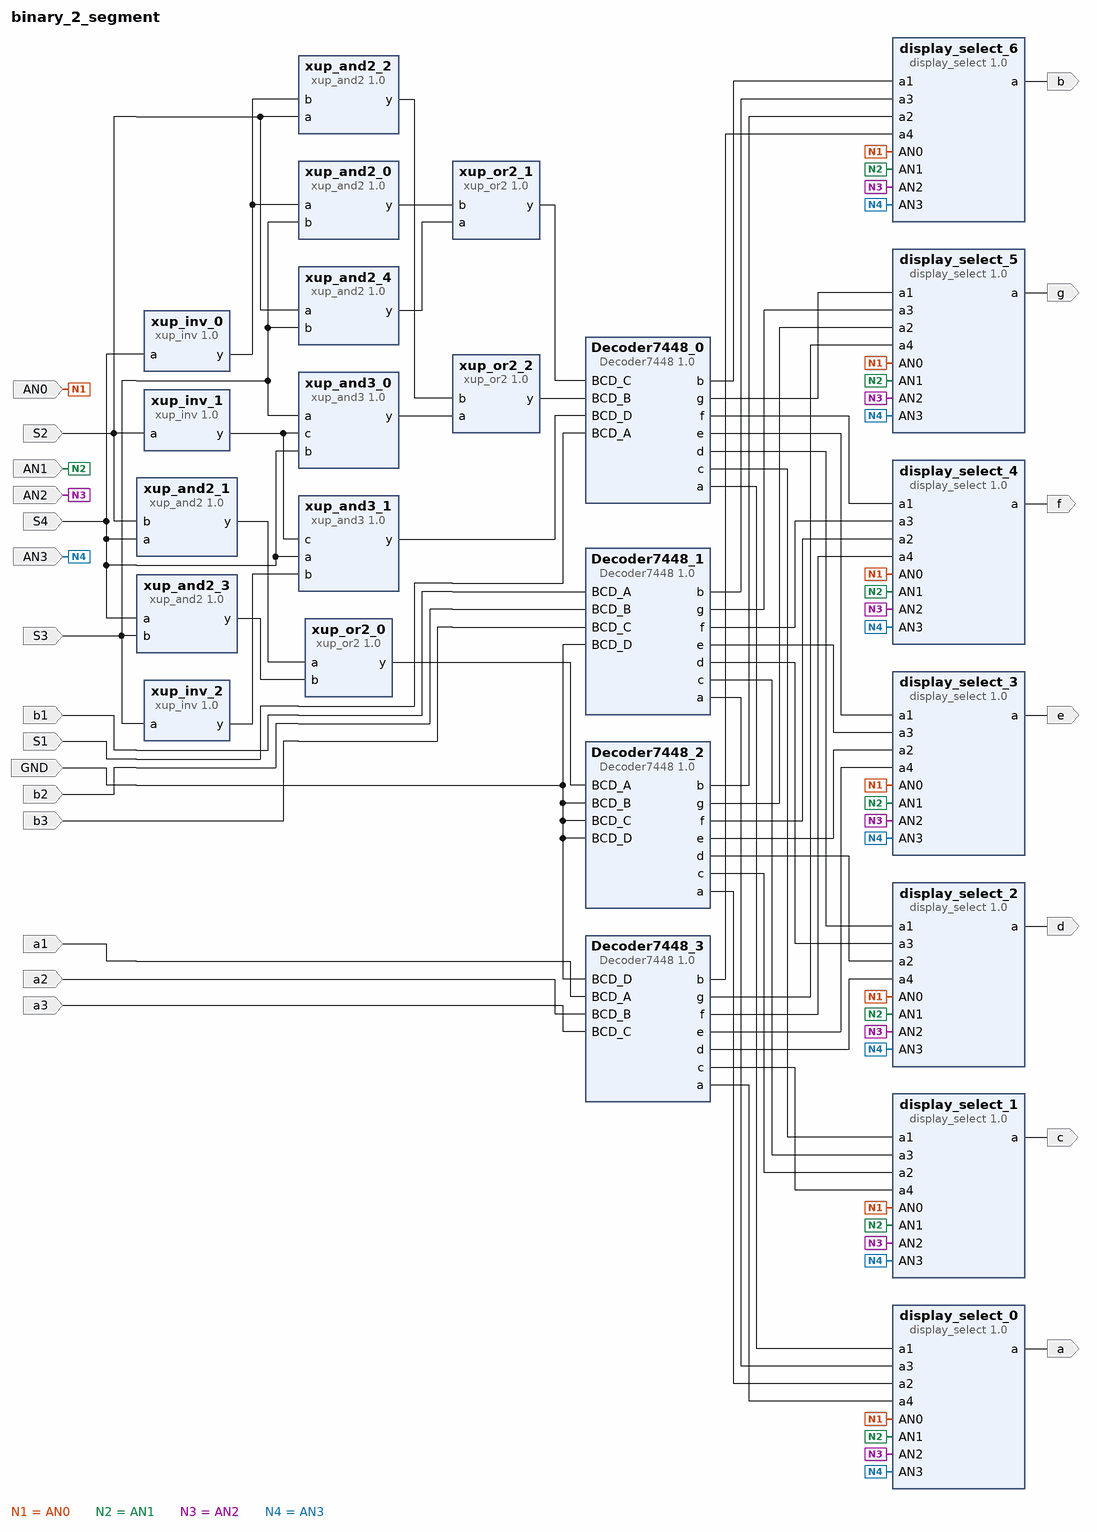
[diagram p0: block diagram of the top level]
# Vivado block design binary_2_segment, xc7a35tcpg236-1, Vivado 2021.1
create_bd_design binary_2_segment

create_bd_port -dir I S4
create_bd_port -dir I S2
create_bd_port -dir I S3
create_bd_port -dir I S1
create_bd_port -dir I GND
create_bd_port -dir I b1
create_bd_port -dir I b2
create_bd_port -dir I b3
create_bd_port -dir I a1
create_bd_port -dir I a2
create_bd_port -dir I a3
create_bd_port -dir I AN0
create_bd_port -dir I AN1
create_bd_port -dir I AN2
create_bd_port -dir I AN3
create_bd_port -dir O a
create_bd_port -dir O b
create_bd_port -dir O c
create_bd_port -dir O d
create_bd_port -dir O e
create_bd_port -dir O f
create_bd_port -dir O g

create_bd_cell -type ip -vlnv xilinx.com:xup:xup_inv:1.0 xup_inv_0
create_bd_cell -type ip -vlnv xilinx.com:xup:xup_inv:1.0 xup_inv_1
create_bd_cell -type ip -vlnv xilinx.com:xup:xup_and2:1.0 xup_and2_0
create_bd_cell -type ip -vlnv xilinx.com:xup:xup_and3:1.0 xup_and3_0
create_bd_cell -type ip -vlnv xilinx.com:xup:xup_inv:1.0 xup_inv_2
create_bd_cell -type ip -vlnv xilinx.com:xup:xup_and2:1.0 xup_and2_1
create_bd_cell -type ip -vlnv xilinx.com:xup:xup_and2:1.0 xup_and2_2
create_bd_cell -type ip -vlnv xilinx.com:xup:xup_and2:1.0 xup_and2_3
create_bd_cell -type ip -vlnv xilinx.com:xup:xup_and2:1.0 xup_and2_4
create_bd_cell -type ip -vlnv xilinx.com:xup:xup_or2:1.0 xup_or2_0
create_bd_cell -type ip -vlnv xilinx.com:xup:xup_or2:1.0 xup_or2_1
create_bd_cell -type ip -vlnv xilinx.com:xup:xup_or2:1.0 xup_or2_2
create_bd_cell -type ip -vlnv xilinx.com:xup:xup_and3:1.0 xup_and3_1
create_bd_cell -type ip -vlnv xilinx.com:user:display_select:1.0 display_select_0
create_bd_cell -type ip -vlnv xilinx.com:user:display_select:1.0 display_select_1
create_bd_cell -type ip -vlnv xilinx.com:user:display_select:1.0 display_select_2
create_bd_cell -type ip -vlnv xilinx.com:user:display_select:1.0 display_select_3
create_bd_cell -type ip -vlnv xilinx.com:user:display_select:1.0 display_select_4
create_bd_cell -type ip -vlnv xilinx.com:user:display_select:1.0 display_select_5
create_bd_cell -type ip -vlnv xilinx.com:user:display_select:1.0 display_select_6
create_bd_cell -type ip -vlnv xilinx.com:user:Decoder7448:1.0 Decoder7448_0
create_bd_cell -type ip -vlnv xilinx.com:user:Decoder7448:1.0 Decoder7448_1
create_bd_cell -type ip -vlnv xilinx.com:user:Decoder7448:1.0 Decoder7448_2
create_bd_cell -type ip -vlnv xilinx.com:user:Decoder7448:1.0 Decoder7448_3

# ---- connections ----

connect_bd_net -net AN0_1 [get_bd_ports AN0] \
  [get_bd_pins display_select_0/AN0] [get_bd_pins display_select_1/AN0] [get_bd_pins display_select_2/AN0] \
  [get_bd_pins display_select_3/AN0] [get_bd_pins display_select_4/AN0] [get_bd_pins display_select_5/AN0] \
  [get_bd_pins display_select_6/AN0]
connect_bd_net -net AN1_1 [get_bd_ports AN1] \
  [get_bd_pins display_select_0/AN1] [get_bd_pins display_select_1/AN1] [get_bd_pins display_select_2/AN1] \
  [get_bd_pins display_select_3/AN1] [get_bd_pins display_select_4/AN1] [get_bd_pins display_select_5/AN1] \
  [get_bd_pins display_select_6/AN1]
connect_bd_net -net AN2_1 [get_bd_ports AN2] \
  [get_bd_pins display_select_0/AN2] [get_bd_pins display_select_1/AN2] [get_bd_pins display_select_2/AN2] \
  [get_bd_pins display_select_3/AN2] [get_bd_pins display_select_4/AN2] [get_bd_pins display_select_5/AN2] \
  [get_bd_pins display_select_6/AN2]
connect_bd_net -net AN3_1 [get_bd_ports AN3] \
  [get_bd_pins display_select_0/AN3] [get_bd_pins display_select_1/AN3] [get_bd_pins display_select_2/AN3] \
  [get_bd_pins display_select_3/AN3] [get_bd_pins display_select_4/AN3] [get_bd_pins display_select_5/AN3] \
  [get_bd_pins display_select_6/AN3]
connect_bd_net [get_bd_pins Decoder7448_0/a] [get_bd_pins display_select_0/a1]
connect_bd_net [get_bd_pins Decoder7448_0/b] [get_bd_pins display_select_6/a1]
connect_bd_net [get_bd_pins Decoder7448_0/c] [get_bd_pins display_select_1/a1]
connect_bd_net [get_bd_pins Decoder7448_0/d] [get_bd_pins display_select_2/a1]
connect_bd_net [get_bd_pins Decoder7448_0/e] [get_bd_pins display_select_3/a1]
connect_bd_net [get_bd_pins Decoder7448_0/f] [get_bd_pins display_select_4/a1]
connect_bd_net [get_bd_pins Decoder7448_0/g] [get_bd_pins display_select_5/a1]
connect_bd_net [get_bd_pins Decoder7448_1/a] [get_bd_pins display_select_0/a3]
connect_bd_net [get_bd_pins Decoder7448_1/b] [get_bd_pins display_select_6/a3]
connect_bd_net [get_bd_pins Decoder7448_1/c] [get_bd_pins display_select_1/a3]
connect_bd_net [get_bd_pins Decoder7448_1/d] [get_bd_pins display_select_2/a3]
connect_bd_net [get_bd_pins Decoder7448_1/e] [get_bd_pins display_select_3/a3]
connect_bd_net [get_bd_pins Decoder7448_1/f] [get_bd_pins display_select_4/a3]
connect_bd_net [get_bd_pins Decoder7448_1/g] [get_bd_pins display_select_5/a3]
connect_bd_net [get_bd_pins Decoder7448_2/a] [get_bd_pins display_select_0/a2]
connect_bd_net [get_bd_pins Decoder7448_2/b] [get_bd_pins display_select_6/a2]
connect_bd_net [get_bd_pins Decoder7448_2/c] [get_bd_pins display_select_1/a2]
connect_bd_net [get_bd_pins Decoder7448_2/d] [get_bd_pins display_select_2/a2]
connect_bd_net [get_bd_pins Decoder7448_2/e] [get_bd_pins display_select_3/a2]
connect_bd_net [get_bd_pins Decoder7448_2/f] [get_bd_pins display_select_4/a2]
connect_bd_net [get_bd_pins Decoder7448_2/g] [get_bd_pins display_select_5/a2]
connect_bd_net [get_bd_pins Decoder7448_3/a] [get_bd_pins display_select_0/a4]
connect_bd_net [get_bd_pins Decoder7448_3/b] [get_bd_pins display_select_6/a4]
connect_bd_net [get_bd_pins Decoder7448_3/c] [get_bd_pins display_select_1/a4]
connect_bd_net [get_bd_pins Decoder7448_3/d] [get_bd_pins display_select_2/a4]
connect_bd_net [get_bd_pins Decoder7448_3/e] [get_bd_pins display_select_3/a4]
connect_bd_net [get_bd_pins Decoder7448_3/f] [get_bd_pins display_select_4/a4]
connect_bd_net [get_bd_pins Decoder7448_3/g] [get_bd_pins display_select_5/a4]
connect_bd_net [get_bd_ports GND] \
  [get_bd_pins Decoder7448_1/BCD_D] [get_bd_pins Decoder7448_2/BCD_B] [get_bd_pins Decoder7448_2/BCD_C] \
  [get_bd_pins Decoder7448_2/BCD_D] [get_bd_pins Decoder7448_3/BCD_D]
connect_bd_net -net S1_1 [get_bd_ports S1] [get_bd_pins Decoder7448_0/BCD_A]
connect_bd_net -net S2_1 [get_bd_ports S2] [get_bd_pins xup_inv_1/a] [get_bd_pins xup_and2_1/b] [get_bd_pins xup_and2_2/a] [get_bd_pins xup_and2_4/a]
connect_bd_net -net S3_1 [get_bd_ports S3] \
  [get_bd_pins xup_and2_0/b] [get_bd_pins xup_and2_3/b] [get_bd_pins xup_and2_4/b] [get_bd_pins xup_inv_2/a] \
  [get_bd_pins xup_and3_0/a]
connect_bd_net -net S4_1 [get_bd_ports S4] \
  [get_bd_pins xup_inv_0/a] [get_bd_pins xup_and2_3/a] [get_bd_pins xup_and3_0/b] [get_bd_pins xup_and2_1/a] \
  [get_bd_pins xup_and3_1/a]
connect_bd_net -net a1_1 [get_bd_ports a1] [get_bd_pins Decoder7448_3/BCD_A]
connect_bd_net -net a2_1 [get_bd_ports a2] [get_bd_pins Decoder7448_3/BCD_B]
connect_bd_net -net a3_1 [get_bd_ports a3] [get_bd_pins Decoder7448_3/BCD_C]
connect_bd_net -net b1_1 [get_bd_ports b1] [get_bd_pins Decoder7448_1/BCD_A]
connect_bd_net -net b2_1 [get_bd_ports b2] [get_bd_pins Decoder7448_1/BCD_B]
connect_bd_net -net b3_1 [get_bd_ports b3] [get_bd_pins Decoder7448_1/BCD_C]
connect_bd_net [get_bd_pins display_select_0/a] [get_bd_ports a]
connect_bd_net [get_bd_pins display_select_1/a] [get_bd_ports c]
connect_bd_net [get_bd_pins display_select_2/a] [get_bd_ports d]
connect_bd_net [get_bd_pins display_select_3/a] [get_bd_ports e]
connect_bd_net [get_bd_pins display_select_4/a] [get_bd_ports f]
connect_bd_net [get_bd_pins display_select_5/a] [get_bd_ports g]
connect_bd_net [get_bd_pins display_select_6/a] [get_bd_ports b]
connect_bd_net [get_bd_pins xup_and2_0/y] [get_bd_pins xup_or2_1/b]
connect_bd_net [get_bd_pins xup_and2_1/y] [get_bd_pins xup_or2_0/a]
connect_bd_net [get_bd_pins xup_and2_2/y] [get_bd_pins xup_or2_2/b]
connect_bd_net [get_bd_pins xup_and2_3/y] [get_bd_pins xup_or2_0/b]
connect_bd_net [get_bd_pins xup_and2_4/y] [get_bd_pins xup_or2_1/a]
connect_bd_net [get_bd_pins xup_and3_0/y] [get_bd_pins xup_or2_2/a]
connect_bd_net [get_bd_pins xup_and3_1/y] [get_bd_pins Decoder7448_0/BCD_D]
connect_bd_net [get_bd_pins xup_inv_0/y] [get_bd_pins xup_and2_0/a] [get_bd_pins xup_and2_2/b]
connect_bd_net [get_bd_pins xup_inv_1/y] [get_bd_pins xup_and3_0/c] [get_bd_pins xup_and3_1/c]
connect_bd_net [get_bd_pins xup_inv_2/y] [get_bd_pins xup_and3_1/b]
connect_bd_net [get_bd_pins xup_or2_0/y] [get_bd_pins Decoder7448_2/BCD_A]
connect_bd_net [get_bd_pins xup_or2_1/y] [get_bd_pins Decoder7448_0/BCD_C]
connect_bd_net [get_bd_pins xup_or2_2/y] [get_bd_pins Decoder7448_0/BCD_B]

validate_bd_design
save_bd_design
